# EAGLE design hamstackHAT (EAGLE 7.2.0)
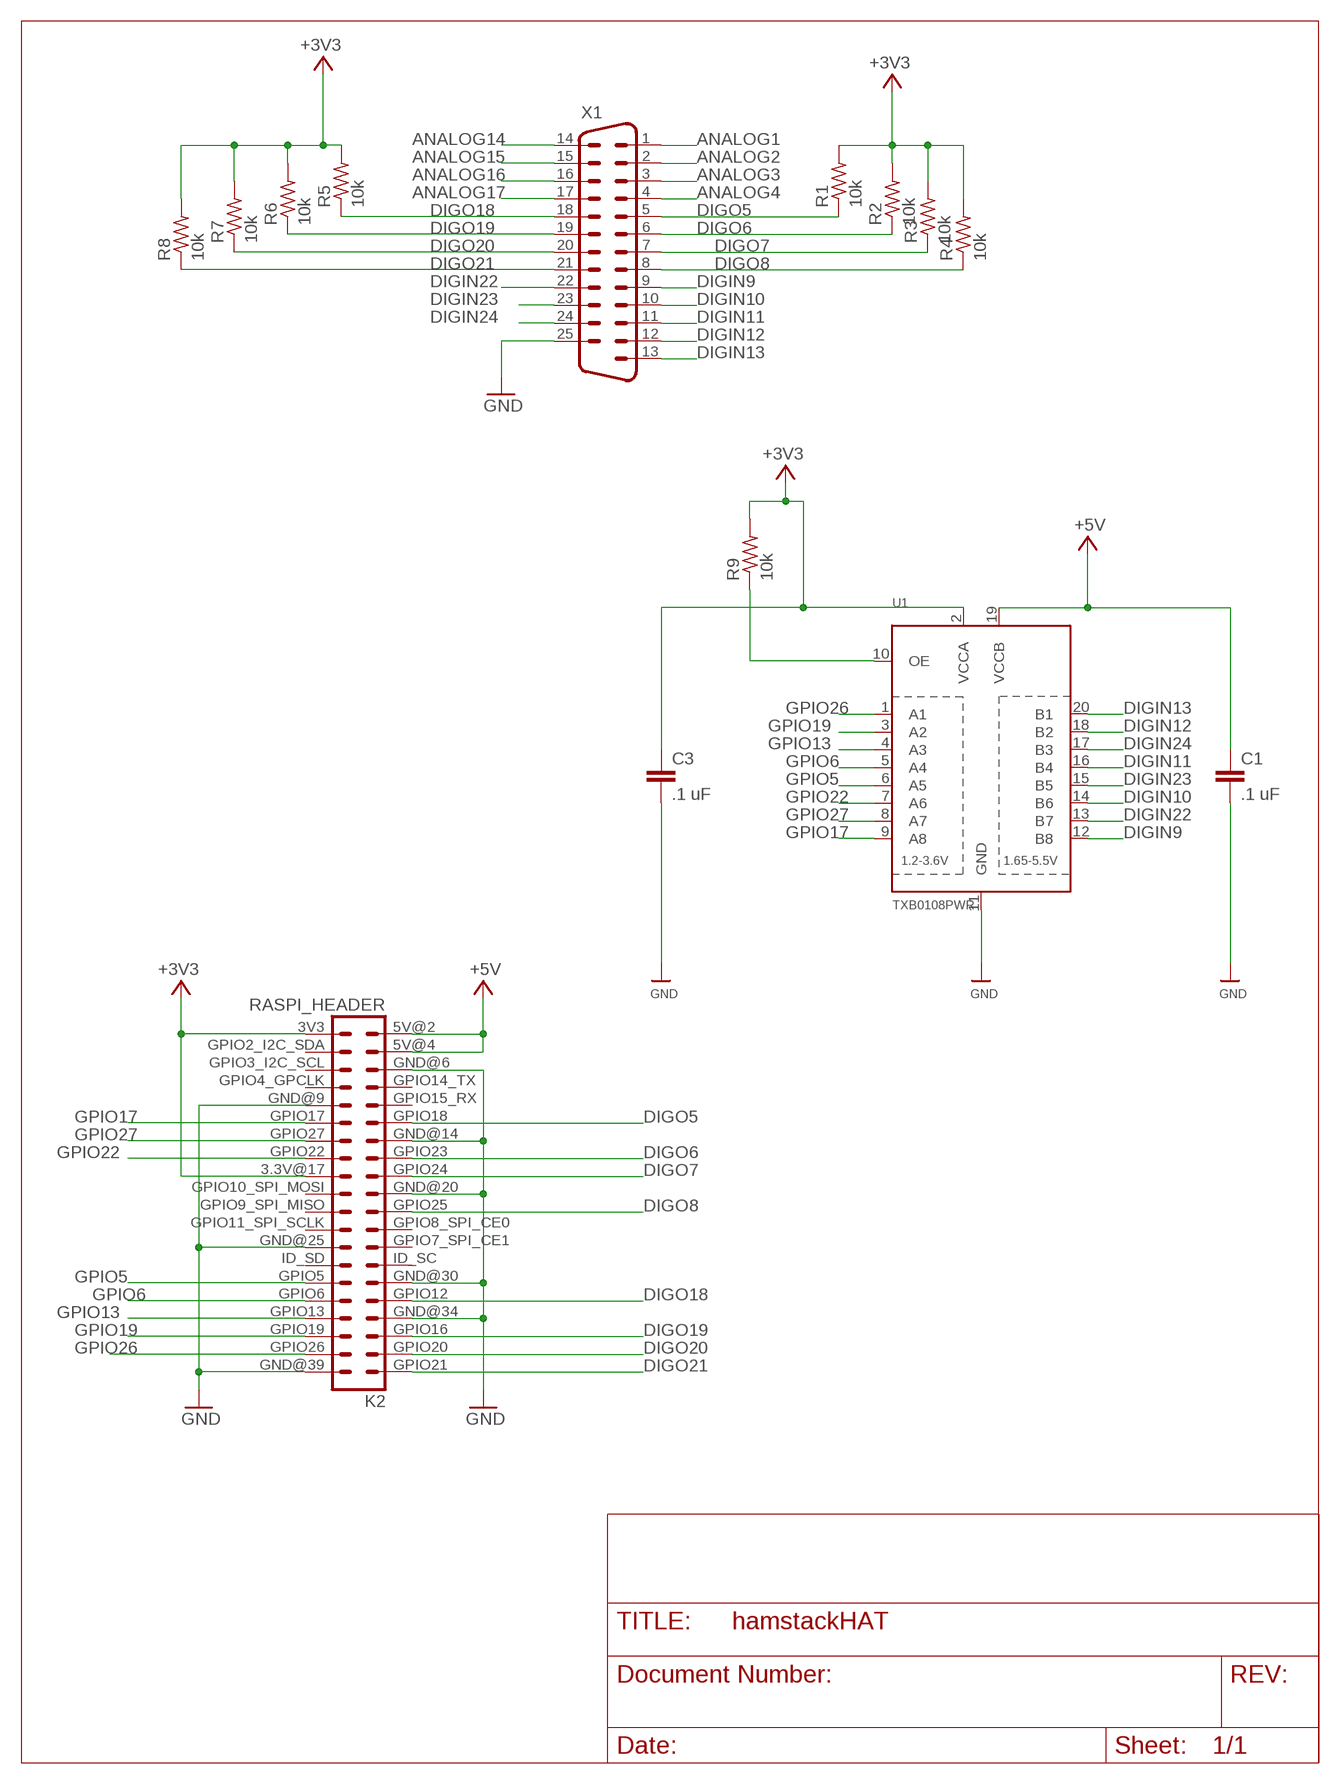
[diagram p0: schematic, sheet 1]

## Parts
C1  .1 uF  0.1UF-50V-20%(PTH)KIT-EZ  [CAP-PTH-SMALL-KIT]
C3  .1 uF  0.1UF-50V-20%(PTH)KIT-EZ  [CAP-PTH-SMALL-KIT]
K2  RASPI_HEADER  [RASPI_HEADER]
R1  10k  R-US_0207/10  [0207/10]
R2  10k  R-US_0207/10  [0207/10]
R3  10k  R-US_0207/10  [0207/10]
R4  10k  R-US_0207/10  [0207/10]
R5  10k  R-US_0207/10  [0207/10]
R6  10k  R-US_0207/10  [0207/10]
R7  10k  R-US_0207/10  [0207/10]
R8  10k  R-US_0207/10  [0207/10]
R9  10k  R-US_0207/10  [0207/10]
U1  TXB0108PWR  [TSSOP20]
X1  M25HP  [M25HP]

## Nets
+3V3: C3.1 K2.3.3V@17 K2.3V3 R1.2 R2.2 R3.2 R4.2 R5.2 R6.2 R7.2 R8.2 R9.2 U1.2(VCCA)
+5V: C1.1 K2.5V@2 K2.5V@4 U1.19(VCCB)
ANALOG1: X1.1
ANALOG2: X1.2
ANALOG3: X1.3
ANALOG4: X1.4
ANALOG14: X1.14
ANALOG15: X1.15
ANALOG16: X1.16
ANALOG17: X1.17
DIGIN9: U1.12(B8) X1.9
DIGIN10: U1.14(B6) X1.10
DIGIN11: U1.16(B4) X1.11
DIGIN12: U1.18(B2) X1.12
DIGIN13: U1.20(B1) X1.13
DIGIN22: U1.13(B7) X1.22
DIGIN23: U1.15(B5) X1.23
DIGIN24: U1.17(B3) X1.24
DIGO5: K2.GPIO18 R1.1 X1.5
DIGO6: K2.GPIO23 R2.1 X1.6
DIGO7: K2.GPIO24 R3.1 X1.7
DIGO8: K2.GPIO25 R4.1 X1.8
DIGO18: K2.GPIO12 R5.1 X1.18
DIGO19: K2.GPIO16 R6.1 X1.19
DIGO20: K2.GPIO20 R7.1 X1.20
DIGO21: K2.GPIO21 R8.1 X1.21
GND: C1.2 C3.2 K2.GND@6 K2.GND@9 K2.GND@14 K2.GND@20 K2.GND@25 K2.GND@30 K2.GND@34 K2.GND@39 U1.11(GND) X1.25
GPIO5: K2.GPIO5 U1.6(A5)
GPIO6: K2.GPIO6 U1.5(A4)
GPIO13: K2.GPIO13 U1.4(A3)
GPIO17: K2.GPIO17 U1.9(A8)
GPIO19: K2.GPIO19 U1.3(A2)
GPIO22: K2.GPIO22 U1.7(A6)
GPIO26: K2.GPIO26 U1.1(A1)
GPIO27: K2.GPIO27 U1.8(A7)
N$20: R9.1 U1.10(OE)
Unconnected: K2.GPIO2_I2C_SDA K2.GPIO3_I2C_SCL K2.GPIO4_GPCLK K2.GPIO7_SPI_CE1 K2.GPIO8_SPI_CE0 K2.GPIO9_SPI_MISO K2.GPIO10_SPI_MOSI K2.GPIO11_SPI_SCLK K2.GPIO14_TX K2.GPIO15_RX K2.ID_SC K2.ID_SD X1.G1 X1.G2

## Library data of the parts
C1 C3 = SparkFun-Capacitors:0.1UF-50V-20%(PTH): CAP-08370; PROD_ID: CAP-08370
K2 = RasPi-BplusHAT:RASPI_HEADER: raspberrypi gpio header
R1-R9 = resistor:R-US_: RESISTOR, American symbol
U1 = microbuilder:TXB0108PWR: 8-Bit Bi-Directional Level Shifter 1.2V-3.6V (VCCA) to 1.65V-5.5V (VCCB) bi-directional level shifter with auto direction sensing. Max data rate - VCCA 1.8V: 20Mbps (50ns), VCCA 3.3V: 100Mbps (10ns) Digikey: 296-21527-1-ND
X1 = con-subd:M25HP: SUB-D; OC_FARNELL: unknown; OC_NEWARK: unknown

## Board
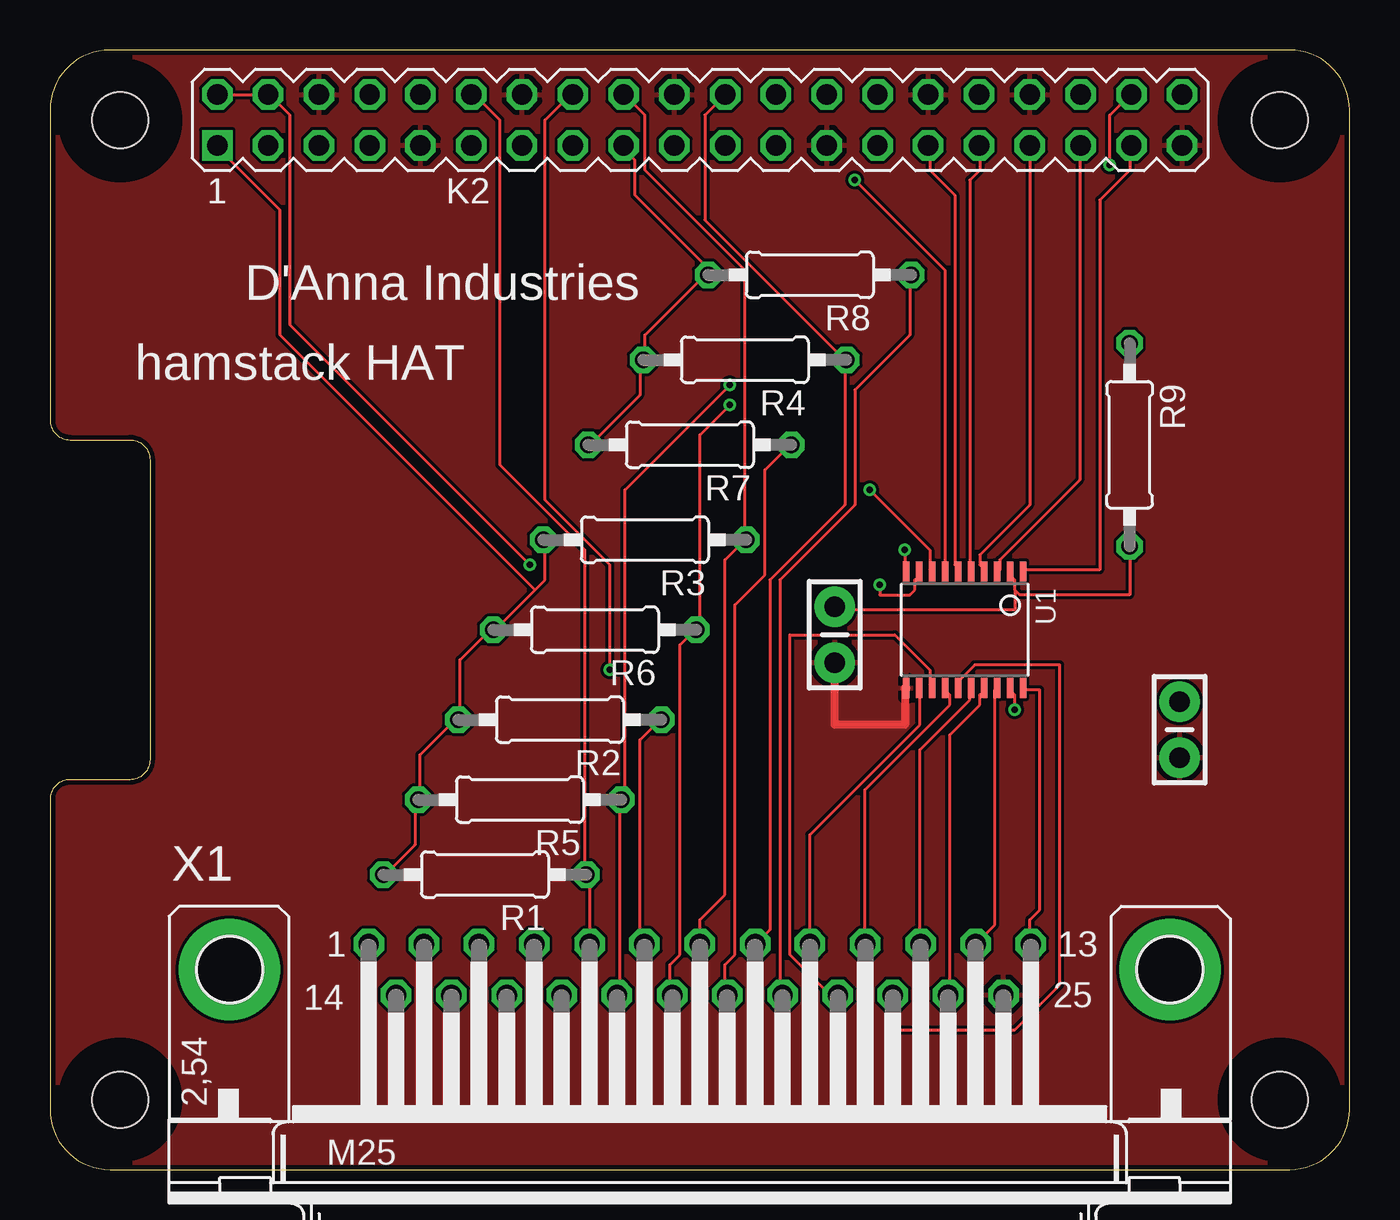
[diagram p1: board, top side]
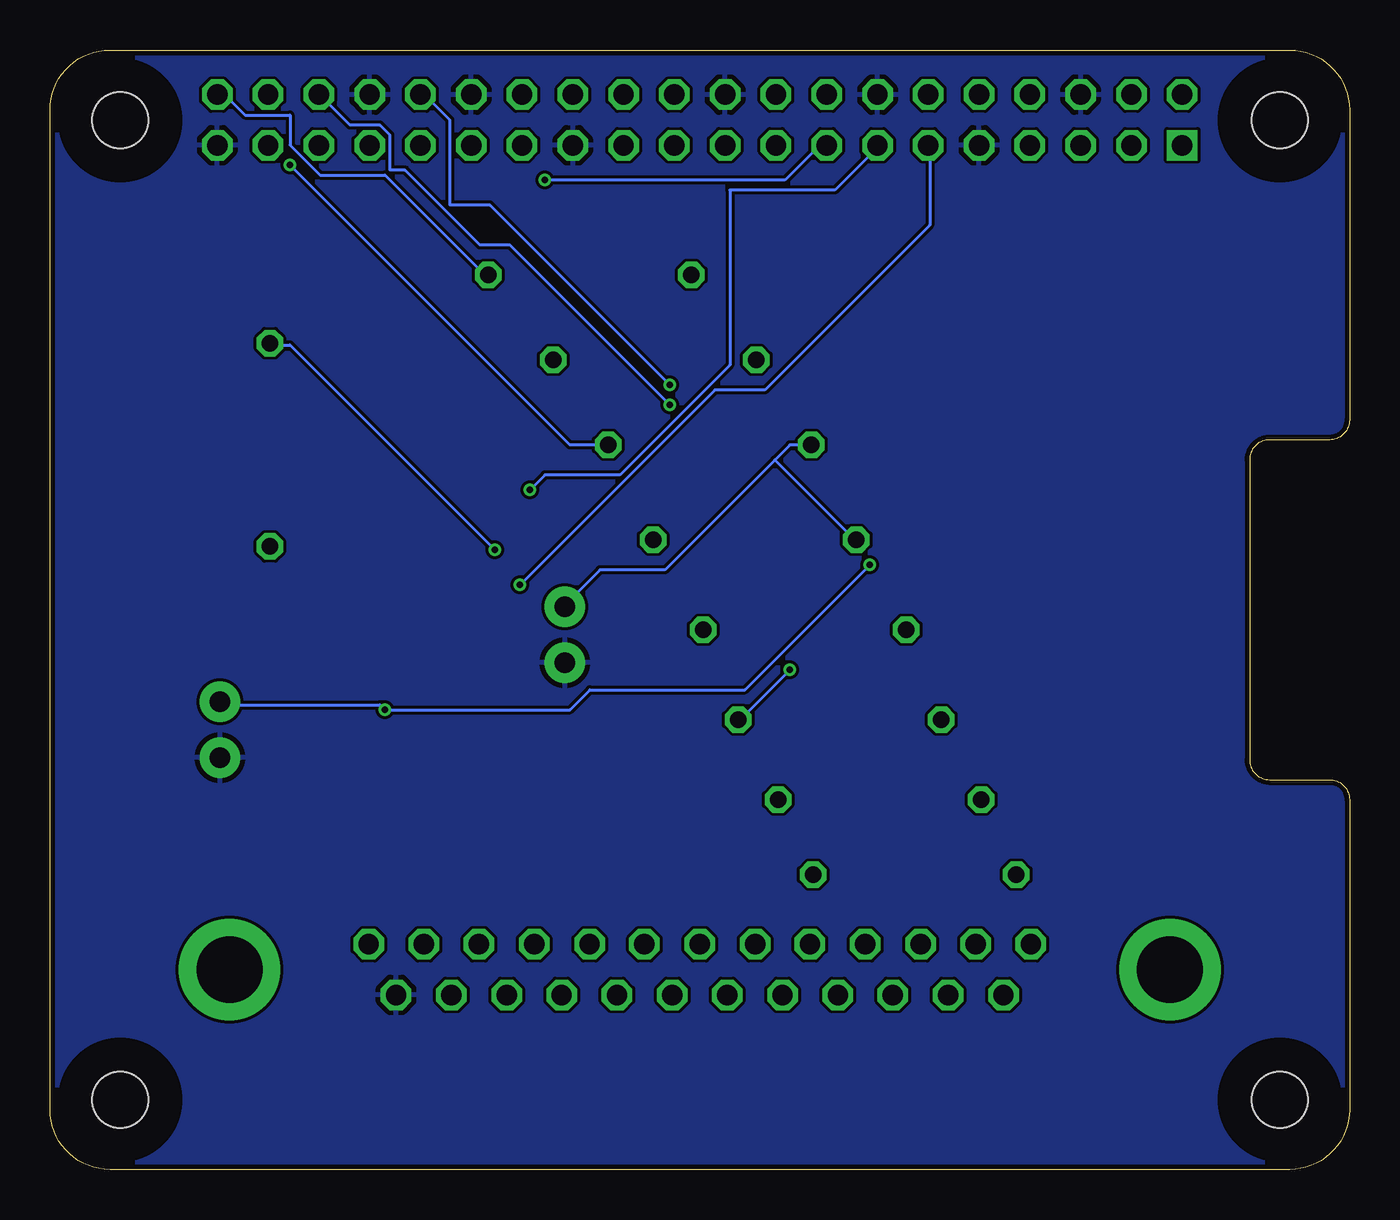
[diagram p2: board, bottom side, seen from below]

Size 65 x 56 mm. Coordinates in mm from the lower left corner, seen from the top.
Outline: 0,3 arc90 3,0 62,0 arc90 65,3 65,53 arc90 62,56 3,56 arc90 0,53 0,37.5 arc90 1,36.5 4,36.5 arc-90 5,35.5 5,20.5 arc-90 4,19.5 1,19.5 arc90 0,18.5 0,3
Copper layers (1*16): Top 0.035mm / dielectric 1.5mm / Bottom 0.035mm
Design rules "ITEADstudio_DRC": minimum track width 6mil, minimum drill 12mil, track to track 6mil, track to pad 6mil, pad to pad 6mil, via to via 6mil, smd to smd 0mil, copper to edge 10mil, drill to drill 10mil, minimum pad ring 10mil, minimum via ring 6mil, stop-mask expansion 2mil, vias tented up to drill 100mil, thermal gap 10mil
Holes 2.8 mm at 3.5,3.5 3.5,52.5 61.5,52.5 61.5,3.5
tRestrict: area 1.9,51 to 5,54; area 60,51 to 63,54; area 60,1.9 to 63,5; area 1.9,1.9 to 5,5
bRestrict: area 1.9,1.9 to 5,5; area 1.9,51 to 5,54; area 60,1.9 to 63,5; area 60,51 to 63,54

### Footprints (pad centres in the part's own frame; a part is rotated, then mirrored left to right if it is on the bottom)
CAP-PTH-SMALL-KIT = drill 1.016 pad 2.032: 1 -1.397,0; 2 1.397,0
RASPI_HEADER = drill 1.016 octagon: 3.3V@17 -3.81,-1.27; 5V@2 -24.13,1.27; 5V@4 -21.59,1.27; GND@6 -19.05,1.27; GND@9 -13.97,-1.27; GND@14 -8.89,1.27; GND@20 -1.27,1.27; GND@25 6.35,-1.27; GND@30 11.43,1.27; GND@34 16.51,1.27; GND@39 24.13,-1.27; GPIO2_I2C_SDA -21.59,-1.27; GPIO3_I2C_SCL -19.05,-1.27; GPIO4_GPCLK -16.51,-1.27; GPIO5 11.43,-1.27; GPIO6 13.97,-1.27; GPIO7_SPI_CE1 6.35,1.27; GPIO8_SPI_CE0 3.81,1.27; GPIO9_SPI_MISO 1.27,-1.27; GPIO10_SPI_MOSI -1.27,-1.27; GPIO11_SPI_SCLK 3.81,-1.27; GPIO12 13.97,1.27; GPIO13 16.51,-1.27; GPIO14_TX -16.51,1.27; GPIO15_RX -13.97,1.27; GPIO16 19.05,1.27; GPIO17 -11.43,-1.27; GPIO18 -11.43,1.27; GPIO19 19.05,-1.27; GPIO20 21.59,1.27; GPIO21 24.13,1.27; GPIO22 -6.35,-1.27; GPIO23 -6.35,1.27; GPIO24 -3.81,1.27; GPIO25 1.27,1.27; GPIO26 21.59,-1.27; GPIO27 -8.89,-1.27; ID_SC 8.89,1.27; ID_SD 8.89,-1.27 | drill 1.016 square: 3V3 -24.13,-1.27
0207/10 = drill 0.813 octagon: 1 -5.08,0; 2 5.08,0
TSSOP20 = smd 0.305 x 0.991: 1 -2.925,-2.918; 2 -2.275,-2.918; 3 -1.625,-2.918; 4 -0.975,-2.918; 5 -0.325,-2.918; 6 0.325,-2.918; 7 0.975,-2.918; 8 1.625,-2.918; 9 2.275,-2.918; 10 2.925,-2.918; 11 2.925,2.918; 12 2.275,2.918; 13 1.625,2.918; 14 0.975,2.918; 15 0.325,2.918; 16 -0.325,2.918; 17 -0.975,2.918; 18 -1.625,2.918; 19 -2.275,2.918; 20 -2.925,2.918
M25HP = drill 1.016 octagon: 1 -16.561,1.27; 2 -13.792,1.27; 3 -11.049,1.27; 4 -8.28,1.27; 5 -5.512,1.27; 6 -2.769,1.27; 7 0,1.27; 8 2.769,1.27; 9 5.512,1.27; 10 8.28,1.27; 11 11.049,1.27; 12 13.792,1.27; 13 16.561,1.27; 14 -15.189,-1.27; 15 -12.421,-1.27; 16 -9.652,-1.27; 17 -6.909,-1.27; 18 -4.14,-1.27; 19 -1.372,-1.27; 20 1.372,-1.27; 21 4.14,-1.27; 22 6.909,-1.27; 23 9.652,-1.27; 24 12.421,-1.27; 25 15.189,-1.27 | drill 3.302 pad 5.08: G1 -23.52,0; G2 23.52,0

### Placement (x,y rotation side)
C1  56.5,22 270 top
C3  39.25,26.75 270 top
K2  32.5,52.5 0 top
R1  21.75,14.75 180 top
R2  25.5,22.5 180 top
R3  29.75,31.5 180 top
R4  34.75,40.5 180 top
R5  23.5,18.5 180 top
R6  27.25,27 180 top
R7  32,36.25 180 top
R8  38,44.75 180 top
R9  54,36.25 270 top
U1  45.75,27 180 top
X1  32.5,10 0 top

### Tracks (layer width: path | path; a pad name or v marks a point on that pad's centre or on a via)
+3V3
  Top 0.152: 48.25,29 48.25,29.5 48,29.75 U1.2 | 48.25,29 48.5,28.75 54,28.75 R9.2 | 48.25,29 48.25,28 39.25,28 C3.1 | R7.2 27,36.25 29.5,38.75 29.5,40.5 R4.2 29.75,40.5 29.75,41.75 32.75,44.75 | 32.75,44.75 32.75,45.25 29.25,48.75 29.25,50.5 28.75,51 K2.3.3V@17 | 32.75,44.75 R8.2 | R1.2 16.75,14.75 18.25,16.25 18.25,18.5 R5.2 18.5,18.5 18.5,20.75 20.25,22.5 R2.2 20.5,22.5 20.5,25.5 22,27 R6.2 22.25,27 24.25,29 | 24.25,29 24.75,29.5 24.75,31.5 R3.2 | 24.25,29 11.5,41.75 11.5,48 8.5,51 K2.3V3
  Bottom 0.152: 28.75,35.5 28,36.25 R7.2 | 28.75,35.5 34.25,30 37.5,30 39.25,28.25 C3.1 | 28.75,35.5 24.75,31.5 R3.2
+5V  (via drill 0.3)
  Top 0.152: K2.5V@2 8.5,53.75 10.75,53.75 K2.5V@4 11,53.75 12,52.75 12,42.25 v24,30.25 | v48.25,23 48.25,23.75 48,24 U1.19
  Bottom 0.152: C1.1 56.5,23.25 48.5,23.25 v48.25,23 39,23 38,24 30.25,24 v24,30.25
DIGIN9
  Top 0.152: U1.12 43.5,24 43.5,22.25 38,16.75 38,11.5 X1.9
DIGIN10
  Top 0.152: U1.14 44.75,24 45,23.75 45,23.25 40.75,19 40.75,11.5 X1.10
DIGIN11
  Top 0.152: U1.16 46,24 46,23.5 43.5,21 43.5,11.5 X1.11
DIGIN12
  Top 0.152: U1.18 47.25,24 47.25,12.25 46.5,11.5 X1.12
DIGIN13
  Top 0.152: U1.20 48.75,24 49.5,24 49.5,13 49,12.5 49,11.5 X1.13
DIGIN22
  Top 0.152: U1.13 44,24.25 44,25 42.25,26.75 37,26.75 37,10.75 39.25,8.5 X1.22
DIGIN23
  Top 0.152: U1.15 45.5,24.25 45.5,24.5 46.25,25.25 50.5,25.25 50.5,9.25 48.25,7 42.25,7 42.25,8.5 X1.23
DIGIN24
  Top 0.152: U1.17 46.75,24 46.5,23.75 46.5,23.25 45,21.75 45,8.75 X1.24
DIGO5
  Top 0.152: X1.5 27,11.5 27,14.75 R1.1 26.75,14.75 26.75,31 22.5,35.25 22.5,52.5 21.25,53.75 K2.GPIO18
DIGO6  (via drill 0.3)
  Top 0.152: R2.1 30.5,22.5 29.5,21.5 29.5,11.5 X1.6 | v28,25 28,30.25 24.75,33.5 24.75,52.5 26,53.75 K2.GPIO23
  Bottom 0.152: v28,25 30.5,22.5 R2.1
DIGO7
  Top 0.152: 34.75,31.5 33.75,30.5 33.75,13.75 32.5,12.5 X1.7 | 34.75,31.5 34.75,45 29.75,50 29.75,52.75 28.75,53.75 K2.GPIO24 | 34.75,31.5 R3.1
DIGO8
  Top 0.152: 39.75,40.5 32.75,47.5 32.75,52.75 K2.GPIO25 | 39.75,40.5 39.75,33.25 36,29.5 36,12 35.5,11.5 X1.8 | 39.75,40.5 R4.1
DIGO18  (via drill 0.3)
  Top 0.152: X1.18 28.5,8.75 28.5,18.5 R5.1 28.75,18.5 28.75,34 v34,39.25
  Bottom 0.152: v34,39.25 43,48.25 45,48.25 45,52.5 46.25,53.75 K2.GPIO12
DIGO19  (via drill 0.3)
  Top 0.152: X1.19 31,8.75 31,10.25 31.5,10.75 31.5,26.25 32.25,27 R6.1 32.5,27 32.5,36.75 v34,38.25
  Bottom 0.152: v34,38.25 42,46.25 43.5,46.25 47.25,50 48,50 48,51.75 48.5,52.25 50,52.25 51.5,53.75 K2.GPIO16
DIGO20  (via drill 0.3)
  Top 0.152: R7.1 37,36.25 35.75,35 35.75,29.75 34.25,28.25 34.25,10.75 33.75,10.25 33.75,8.75 X1.20 | v53,50.25 53,52.75 54,53.75 K2.GPIO20
  Bottom 0.152: v53,50.25 39,36.25 R7.1
DIGO21
  Top 0.152: X1.21 36.5,8.75 36.5,29.5 40.25,33.25 40.25,39 43,41.75 43,44.75 R8.1
  Bottom 0.152: R8.1 43.25,44.75 48.25,49.75 51.5,49.75 53,51.25 53,52.75 55.25,52.75 56.25,53.75 56.5,53.75 K2.GPIO21
GND
  Top 0.406: U1.11 42.75,24.08 42.75,22.25 39.25,22.25 C3.2
  pour Bottom: 0,3 arc90 3,0 62,0 arc90 65,3 65,53 arc90 62,56 3,56 arc90 0,53 0,37.5 arc90 1,36.5 4,36.5 arc-90 5,35.5 5,20.5 arc-90 4,19.5 1,19.5 arc90 0,18.5
  pour Top: 0,3 arc90 3,0 62,0 arc90 65,3 65,53 arc90 62,56 3,56 arc90 0,53 0,37.5 arc90 1,36.5 4,36.5 arc-90 5,35.5 5,20.5 arc-90 4,19.5 1,19.5 arc90 0,18.5
GPIO5
  Top 0.152: U1.6 45.5,30 45.25,30.25 45.25,48.75 44,50 44,51 K2.GPIO5
GPIO6
  Top 0.152: U1.5 46,30 46,49.5 46.5,50 46.5,51 K2.GPIO6
GPIO13
  Top 0.152: U1.4 46.75,30 46.5,30.25 46.5,30.75 49,33.25 49,51 K2.GPIO13
GPIO17  (via drill 0.3)
  Top 0.152: v41.5,29.25 41.5,28.75 43,28.75 43.25,29 43.25,29.5 43.5,29.75 U1.9
  Bottom 0.152: v41.5,29.25 31.75,39 29.25,39 21,47.25 21,51 K2.GPIO17
GPIO19
  Top 0.152: U1.3 47.5,30 47.5,30.5 51.5,34.5 51.5,51 K2.GPIO19
GPIO22  (via drill 0.3)
  Top 0.152: v40.25,49.5 44.75,45 44.75,30 U1.7
  Bottom 0.152: v40.25,49.5 28.25,49.5 26.75,51 26.25,51 K2.GPIO22
GPIO26
  Top 0.152: U1.1 48.75,30 52.5,30 52.5,48.5 54,50 54,51 K2.GPIO26
GPIO27  (via drill 0.3)
  Top 0.152: v41,34 44,31 44,30 U1.8
  Bottom 0.152: v41,34 40.25,34.75 36.5,34.75 31,40.25 31,49 25.75,49 23.75,51 K2.GPIO27
N$20  (via drill 0.3)
  Top 0.152: v42.75,31 42.75,30 U1.10
  Bottom 0.152: v42.75,31 53,41.25 54,41.25 R9.1

### Text on the board
tPlace: D'Anna Industries | hamstack HAT